# EAGLE schematic VCA (EAGLE 7.5.0)
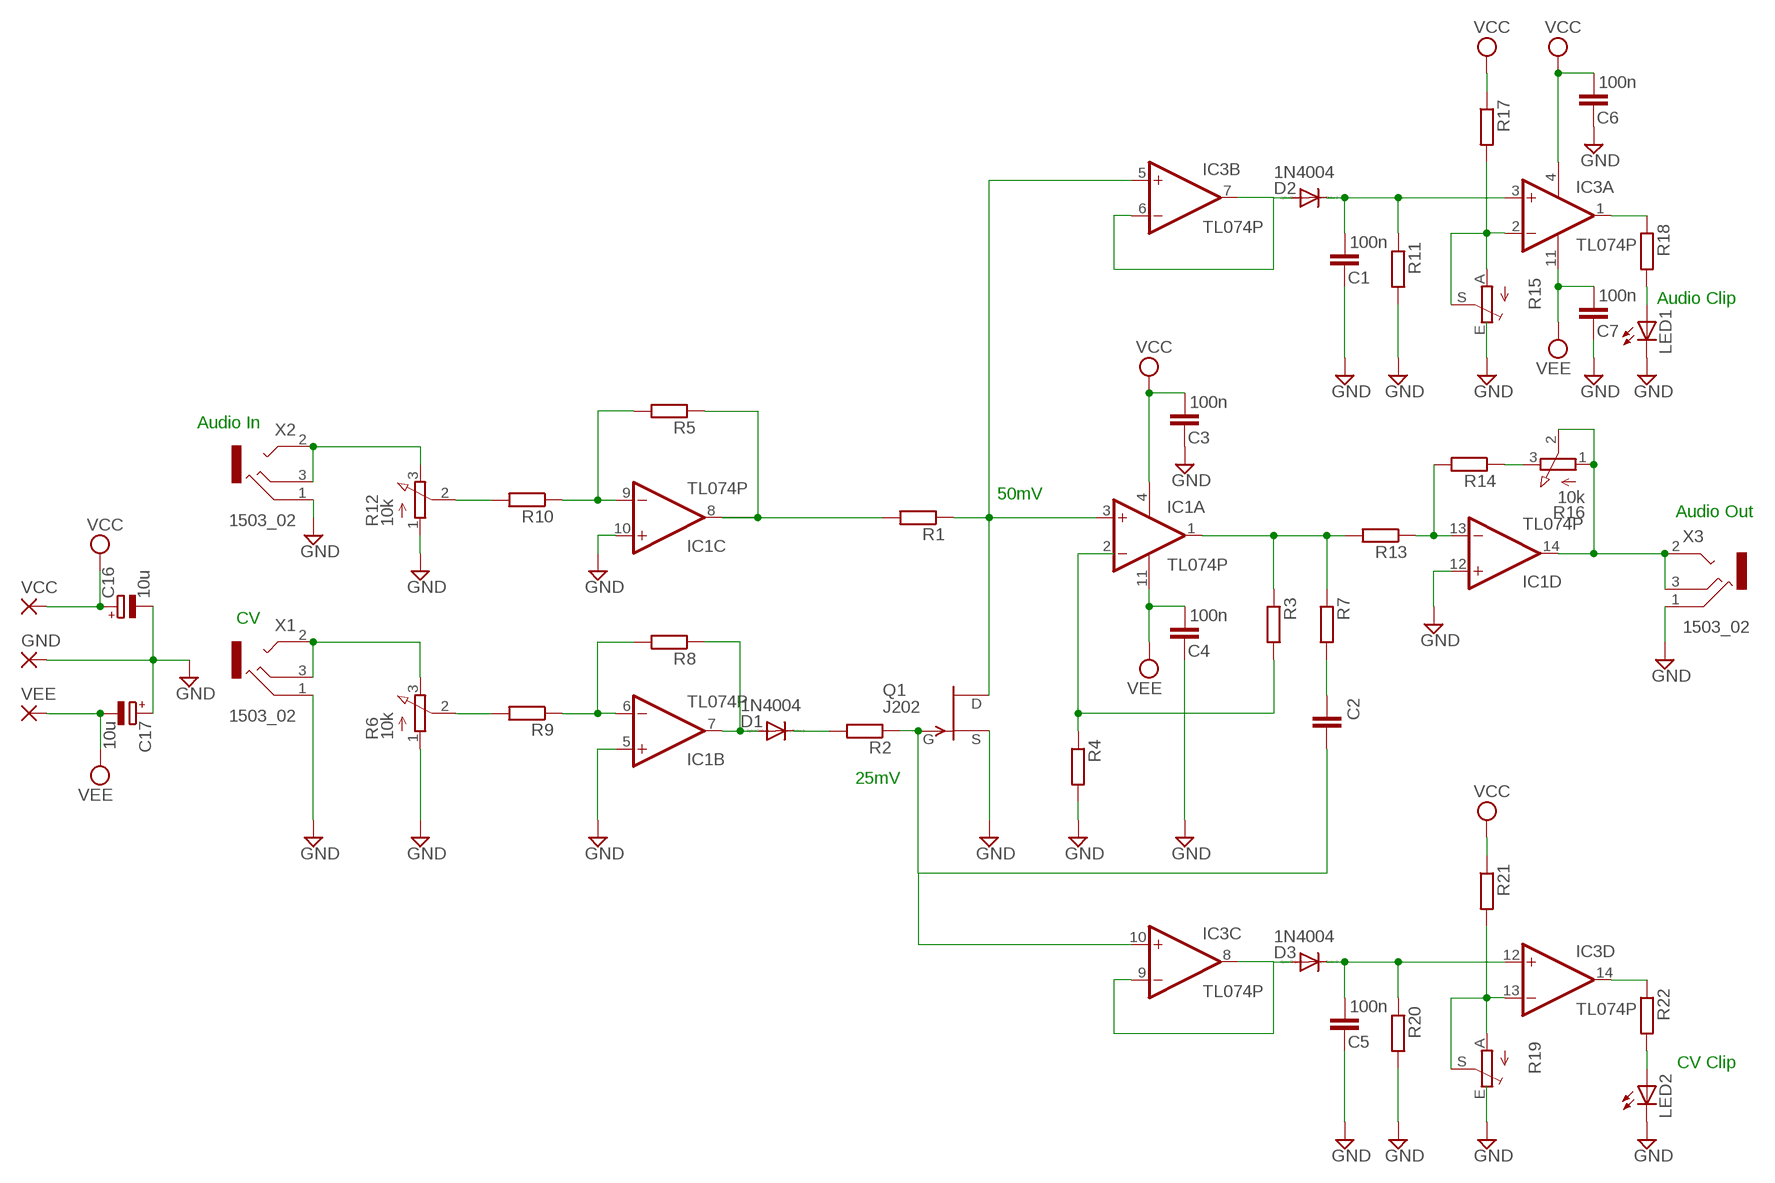
[diagram p0: schematic, sheet 1]

## Parts
C1  100n  C5/2.5  [C5B2.5]
C2  C-EU050-045X075  [C050-045X075]
C3  100n  C5/2.5  [C5B2.5]
C4  100n  C5/2.5  [C5B2.5]
C5  100n  C5/2.5  [C5B2.5]
C6  100n  C5/2.5  [C5B2.5]
C7  100n  C5/2.5  [C5B2.5]
C16  10u  CPOL-EUE2.5-7  [E2,5-7]
C17  10u  CPOL-EUE2.5-7  [E2,5-7]
D1  1N4004  [DO41-10]
D2  1N4004  [DO41-10]
D3  1N4004  [DO41-10]
GND  3,17/1,1  [3,17/1,1]
IC1  TL074P  [DIL14]
IC3  TL074P  [DIL14]
LED1  LED5MM  [LED5MM]
LED2  LED5MM  [LED5MM]
Q1  J202  [TO92]
R1  R-EU_0207/10  [0207/10]
R2  R-EU_0207/10  [0207/10]
R3  R-EU_0207/10  [0207/10]
R4  R-EU_0207/10  [0207/10]
R5  R-EU_0207/10  [0207/10]
R6  10k  3RP/1610N  [3RP/1610N]
R7  R-EU_0207/10  [0207/10]
R8  R-EU_0207/10  [0207/10]
R9  R-EU_0207/10  [0207/10]
R10  R-EU_0207/10  [0207/10]
R11  R-EU_0207/10  [0207/10]
R12  10k  3RP/1610N  [3RP/1610N]
R13  R-EU_0207/10  [0207/10]
R14  R-EU_0207/10  [0207/10]
R15  TRIM_EU-S75P  [S75P]
R16  10k  3RP/1610N  [3RP/1610N]
R17  R-EU_0207/10  [0207/10]
R18  R-EU_0207/10  [0207/10]
R19  TRIM_EU-S75P  [S75P]
R20  R-EU_0207/10  [0207/10]
R21  R-EU_0207/10  [0207/10]
R22  R-EU_0207/10  [0207/10]
VCC  3,17/1,1  [3,17/1,1]
VEE  3,17/1,1  [3,17/1,1]
X1  1503_02  [1503_02]
X2  1503_02  [1503_02]
X3  1503_02  [1503_02]

## Nets
GND: C1.1 C3.1 C4.1 C5.1 C6.1 C7.1 C16.- C17.+ GND.1(P) IC1.5(B:+IN) IC1.10(C:+IN) IC1.12(D:+IN) LED1.K(C) LED2.K(C) Q1.2(S) R4.2 R6.1(A) R11.2 R12.1(A) R20.2 X1.1 X2.1 X3.1
N$1: IC1.3(A:+IN) IC3.5(B:+IN) Q1.3(D) R1.1
N$2: C2.2 IC3.10(C:+IN) Q1.1(G) R2.1
N$3: IC1.2(A:-IN) R3.2 R4.1
N$4: IC1.1(A:OUT) R3.1 R7.1 R13.2
N$5: C2.1 R7.2
N$6: R6.2(S) R9.2
N$7: D1.A IC1.7(B:OUT) R8.1
N$8: IC1.6(B:-IN) R8.2 R9.1
N$9: D1.C R2.2
N$10: R12.3(E) X2.2 X2.3
N$11: IC1.8(C:OUT) R1.2 R5.1
N$12: IC1.9(C:-IN) R5.2 R10.1
N$13: R10.2 R12.2(S)
N$14: IC1.13(D:-IN) R13.1 R14.2
N$15: R6.3(E) X1.2 X1.3
N$16: R14.1 R16.3(E)
N$17: IC1.14(D:OUT) R16.1(A) R16.2(S) X3.2 X3.3
N$18: D2.A IC3.6(B:-IN) IC3.7(B:OUT)
N$19: C1.2 D2.C IC3.3(A:+IN) R11.1
N$20: IC3.2(A:-IN) R15.A R15.S R17.2
N$22: IC3.1(A:OUT) R18.1
N$23: LED1.A R18.2
N$25: D3.A IC3.8(C:OUT) IC3.9(C:-IN)
N$26: C5.2 D3.C IC3.12(D:+IN) R20.1
N$27: IC3.13(D:-IN) R19.A R19.S R21.2
N$28: IC3.14(D:OUT) R22.1
N$29: LED2.A R22.2
VCC: C3.2 C6.2 C16.+ IC1.4(P:V+) R17.1 R21.1 VCC.1(P)
VEE [Power]: C4.2 C7.2 C17.- IC1.11(P:V-) VEE.1(P)
Unconnected: R15.E R19.E X1.2@2 X2.2@2 X3.2@2

## Notes on the sheet
- Audio Clip
- Audio In
- 50mV
- Audio Out
- CV
- 25mV
- CV Clip

## Power pins joined to a net without a drawn wire
V+: IC3.4(P:V+)
V-: IC3.11(P:V-)

## Library data of the parts
C1 C3-C7 = capacitor-wima:C: CAPACITOR naming: grid - package width
C2 = rcl:C-EU: CAPACITOR, European symbol
C16 C17 = rcl:CPOL-EU: POLARIZED CAPACITOR, European symbol
D1-D3 = diode:1N4004: DIODE general purpose rectifier, 1 A
GND VCC VEE = wirepad:3,17/1,1: THROUGH-HOLE PAD
IC1 IC3 = linear:TL074: OP AMP
LED1 LED2 = led:LED: LED OSRAM: - CHIPLED LG R971, LG N971, LY N971, LG Q971, LY Q971, LO R971, LY R971 LH N974, LH R974 LS Q976, LO Q976, LY Q976 LO Q996 - Hyper CHIPLED LW Q18S LB Q993, LB Q99A, LB R99A - SideLED LS A670, LO A670, LY A670, LG A670, LP A670 LB A673, LV A673, LT A673, LW A673 LH A674 LY A675 LS A676, LA A676, LO A676, LY A676, LW A676 LS A679, LY A679, LG A679 - Hyper Micro SIDELED® LS Y876, LA Y876, LO Y876, LY Y876 LT Y87S - SmartLED LW L88C, LW L88S LB L89C, LB L89S, LG L890 LS L89K, LO L89K, LY L89K LS L896, LA L896, LO L896, LY L896 - TOPLED LS T670, LO T670, LY T670, LG T670, LP T670 LSG T670, LSP T670, LSY T670, LOP T670, LYG T670 LG T671, LOG T671, LSG T671 LB T673, LV T673, LT T673, LW T673 LH T674 LS T676, LA T676, LO T676, LY T676, LB T676, LH T676, LSB T676, LW T676 LB T67C, LV T67C, LT T67C, LS T67K, LO T67K, LY T67K, LW E67C LS E67B, LA E67B, LO E67B, LY E67B, LB E67C, LV E67C, LT E67C LW T67C LS T679, LY T679, LG T679 LS T770, LO T770, LY T770, LG T770, LP T770 LB T773, LV T773, LT T773, LW T773 LH T774 LS E675, LA E675, LY E675, LS T675 LS T776, LA T776, LO T776, LY T776, LB T776 LHGB T686 LT T68C, LB T68C - Hyper Mini TOPLED® LB M676 - Mini TOPLED Santana® LG M470 LS M47K, LO M47K, LY M47K Source: http://www.osram.convergy.de LUXEON: - LUMILED® LXK2-PW12-R00, LXK2-PW12-S00, LXK2-PW14-U00, LXK2-PW14-V00 LXK2-PM12-R00, LXK2-PM12-S00, LXK2-PM14-U00 LXK2-PE12-Q00, LXK2-PE12-R00, LXK2-PE12-S00, LXK2-PE14-T00, LXK2-PE14-U00 LXK2-PB12-K00, LXK2-PB12-L00, LXK2-PB12-M00, LXK2-PB14-N00, LXK2-PB14-P00, LXK2-PB14-Q00 LXK2-PR12-L00, LXK2-PR12-M00, LXK2-PR14-Q00, LXK2-PR14-R00 LXK2-PD12-Q00, LXK2-PD12-R00, LXK2-PD12-S00 LXK2-PH12-R00, LXK2-PH12-S00 LXK2-PL12-P00, LXK2-PL12-Q00, LXK2-PL12-R00 Source: www.luxeon.com KINGBRIGHT: KA-3528ASYC Source: www.kingbright.com
Q1 = transistor-fet:?20*: TEMIC / Siliconix N-Channel JFET Source: JFET-J201_Siliconix_data.pdf
R1-R5 R7-R11 R13 R14 R17 R18 R20-R22 = rcl:R-EU_: RESISTOR, European symbol
R6 R12 R16 = pot:3RP/1610N: 16mm Potentiometer one level Source: http://www.alphapotentiometers.net/html/16mm_pot_2.html
R15 R19 = pot:TRIM_EU-: POTENTIOMETER
X1-X3 = con-lumberg:1503_02: Jack connectors according to JISC 6560, 3.5 mm Klinkeneinbaukupplung nach JISC 6560, 3,5 mm, 3-polig/stereo, abgewinkelte Ausführung, Surface-Mount-Technik (SMT) Source: http://www.lumberg.com/Produkte/PDFs/1503_02.pdf; OC_FARNELL: 1216979; OC_NEWARK: unknown

## Net classes
0 default: width 0.508 mm, clearance 0.508 mm
1 Power: width 1.016 mm, clearance 0.508 mm